# Altium schematic sheet Схема блока WiFi.SchDoc
size 420 x 297 mm; Address1: Address1; Address2: Address2; Address3: Address3; Address4: Address4; DocumentNumber: АБВГ.123456.001 Э3; SheetNumber: 1; Scale: 1:1; DocumentType: Схема электрическая принципиальная; FirstReferrence: АБВГ.123456.001
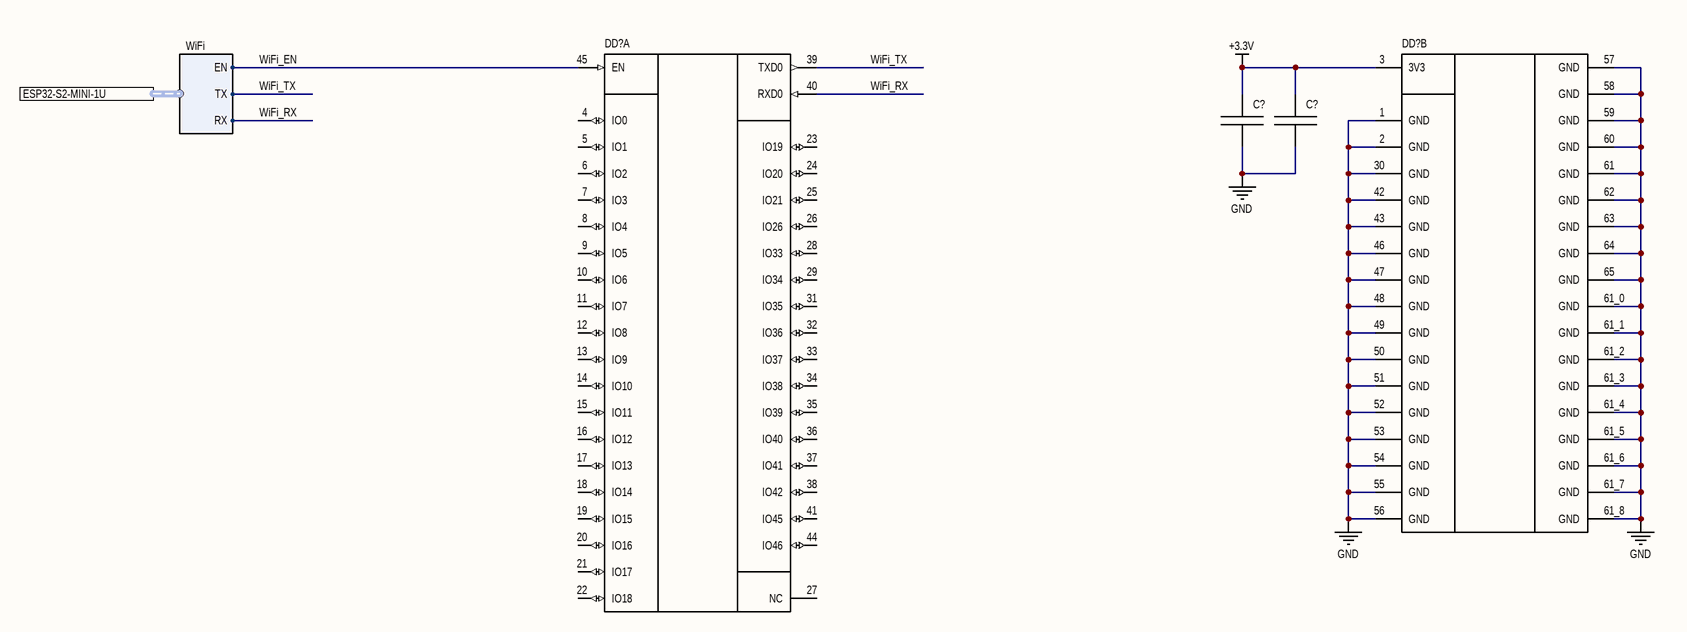
[diagram p0: Схема блока WiFi.SchDoc]

## Parts
(Parts that share a designator on the sheet are numbered #1, #2 ... from top to bottom, then left to right.)
C?#1  *  [CH0805C]  (value not drawn)
C?#2  *  [CH0805C]  (value not drawn)
DD?#1  ESP32­S2­MINI­1U  [MOD: ESP32-S2-MINI-1U]  (value not drawn)  (part A of 2)
DD?#2  ESP32­S2­MINI­1U  [MOD: ESP32-S2-MINI-1U]  (value not drawn)  (part B of 2)

## Ports
ESP32-S2-MINI-1U (harness WiFi)

## Harnesses
WiFi: EN, TX, RX

## Nets
+3.3V: C?#1.1 C?#2.1 DD?#2.3(3V3)
GND: C?#1.2 C?#2.2 DD?#2.1(GND) DD?#2.2(GND) DD?#2.30(GND) DD?#2.42(GND) DD?#2.43(GND) DD?#2.46(GND) DD?#2.47(GND) DD?#2.48(GND) DD?#2.49(GND) DD?#2.50(GND) DD?#2.51(GND) DD?#2.52(GND) DD?#2.53(GND) DD?#2.54(GND) DD?#2.55(GND) DD?#2.56(GND) DD?#2.57(GND) DD?#2.58(GND) DD?#2.59(GND) DD?#2.60(GND) DD?#2.61(GND) DD?#2.61_0(GND) DD?#2.61_1(GND) DD?#2.61_2(GND) DD?#2.61_3(GND) DD?#2.61_4(GND) DD?#2.61_5(GND) DD?#2.61_6(GND) DD?#2.61_7(GND) DD?#2.61_8(GND) DD?#2.62(GND) DD?#2.63(GND) DD?#2.64(GND) DD?#2.65(GND)
WiFi_EN: DD?#1.45(EN) ; port ESP32-S2-MINI-1U.EN
WiFi_RX: DD?#1.40(RXD0) ; port ESP32-S2-MINI-1U.RX
WiFi_TX: DD?#1.39(TXD0) ; port ESP32-S2-MINI-1U.TX

Not connected (* = marked no-connect by the designer): DD?#1 4(IO0) 5(IO1) 6(IO2) 7(IO3) 8(IO4) 9(IO5) 10(IO6) 11(IO7) 12(IO8) 13(IO9) 14(IO10) 15(IO11) 16(IO12) 17(IO13) 18(IO14) 19(IO15) 20(IO16) 21(IO17) 22(IO18) 23(IO19) 24(IO20) 25(IO21) 26(IO26) 27(NC) 28(IO33) 29(IO34) 31(IO35) 32(IO36) 33(IO37) 34(IO38) 35(IO39) 36(IO40) 37(IO41) 38(IO42) 41(IO45) 44(IO46)

## Notes on the sheet
- Подп. и дата
- Инв. № дубл.
- Взам. инв. №
- Инв. № подл.
- Изм.
- Лист
- № докум.
- Подп.
- Дата
- 2.106-A3
- Копировал
- Формат А3

## Library data of the parts
C?#1 C?#2 = Capacitor: Manufacturer: *; Model: *; HelpURL: *; ComponentKind: *; Value: *
DD?#1 DD?#2 = ESP32­S2­MINI­1U: WiFi Module; Manufacturer: Espressif Systems; Model: ESP32-S2-MINI-1U-N4R2; ComponentKind: SMD; HelpURL: https://www.digikey.com/en/products/detail/espressif-systems/ESP32-S2-MINI-1U-N4R2/15222567